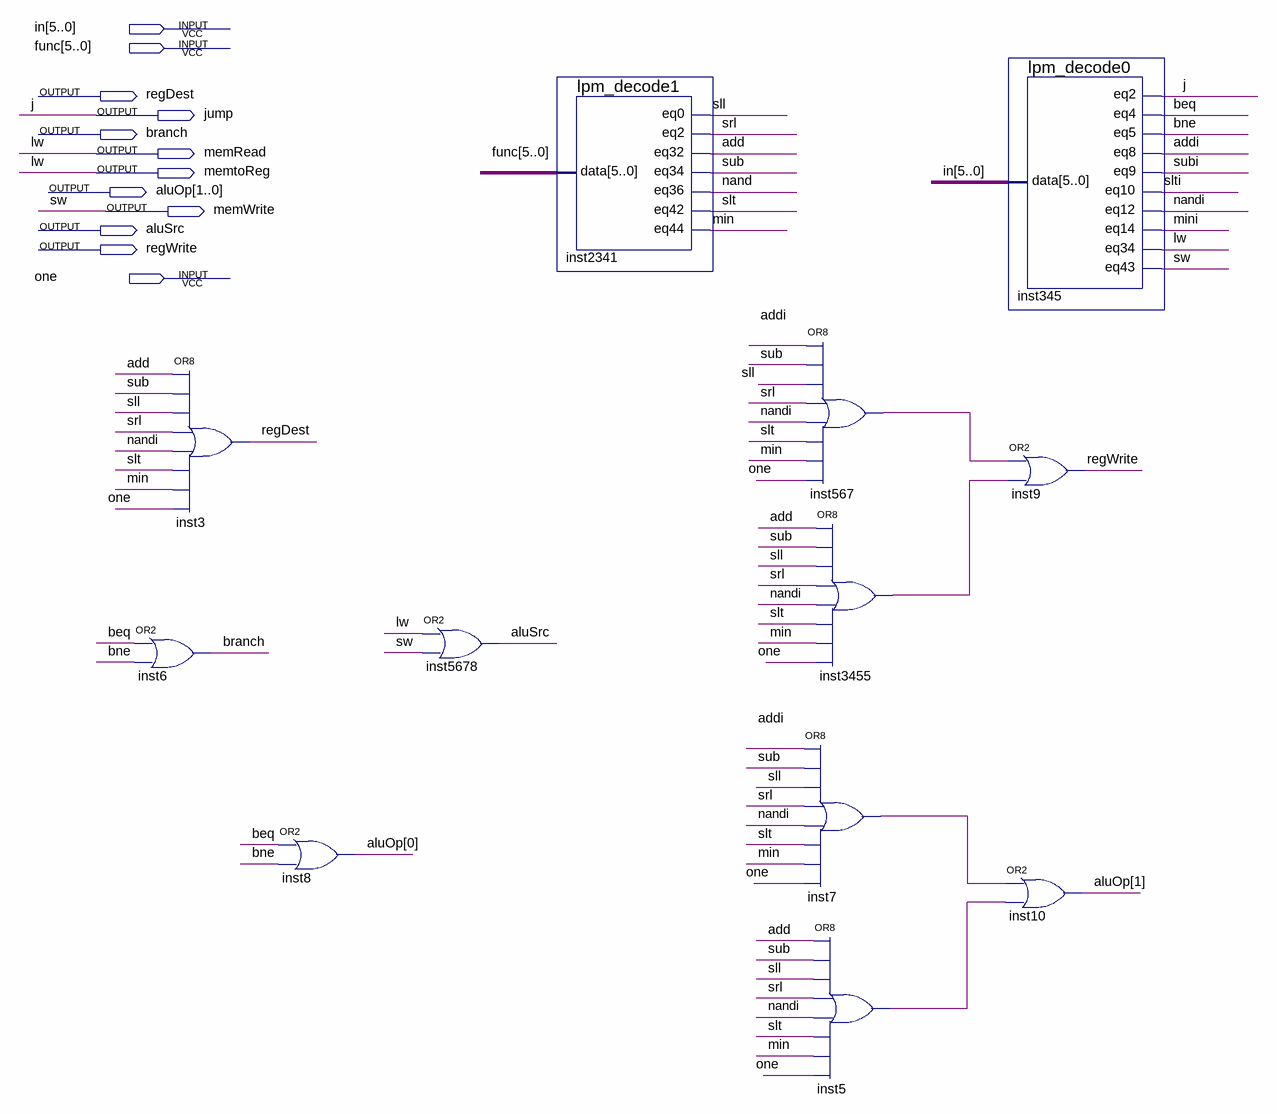
[diagram p0: schematic sheet]
// Quartus schematic controllersingle.bdf as structural Verilog: 12 symbols, 12 pins
module controllersingle (
  input  [5:0] in,
  input  [5:0] func,
  input  one,
  output regDest,
  output jump,
  output branch,
  output memRead,
  output memtoReg,
  output [1:0] aluOp,
  output memWrite,
  output aluSrc,
  output regWrite
);

  wire add, addi, beq, bne, inst5_out, inst7_out, inst567_out, inst3455_out, min, mini, \nand , nandi, sll,
       slt, slti, srl, sub, subi;

  or inst6 (branch, beq, bne);
  or inst3 (regDest, add, sub, sll, srl, nandi, slt, min, one);
  or inst8 (aluOp[0], beq, bne);
  or inst5678 (aluSrc, memRead, memWrite);
  lpm_decode1 inst2341 (
    .data(func), .eq0(sll), .eq2(srl), .eq32(add), .eq34(sub), .eq36(\nand ), .eq42(slt), .eq44(min));
  or inst567 (inst567_out, addi, sub, sll, srl, nandi, slt, min, one);
  or inst3455 (inst3455_out, add, sub, sll, srl, nandi, slt, min, one);
  or inst7 (inst7_out, addi, sub, sll, srl, nandi, slt, min, one);
  or inst5 (inst5_out, add, sub, sll, srl, nandi, slt, min, one);
  lpm_decode0 inst345 (
    .data(in), .eq2(jump), .eq4(beq), .eq5(bne), .eq8(addi), .eq9(subi), .eq10(slti), .eq12(nandi),
    .eq14(mini), .eq34(memRead), .eq43(memWrite));
  or inst9 (regWrite, inst567_out, inst3455_out);
  or inst10 (aluOp[1], inst7_out, inst5_out);

  assign memtoReg = memRead;

  // Other names for the same wires on the sheet: j = jump; lw = memRead; sw = memWrite
endmodule
